# Altium project Relay.PrjPCB
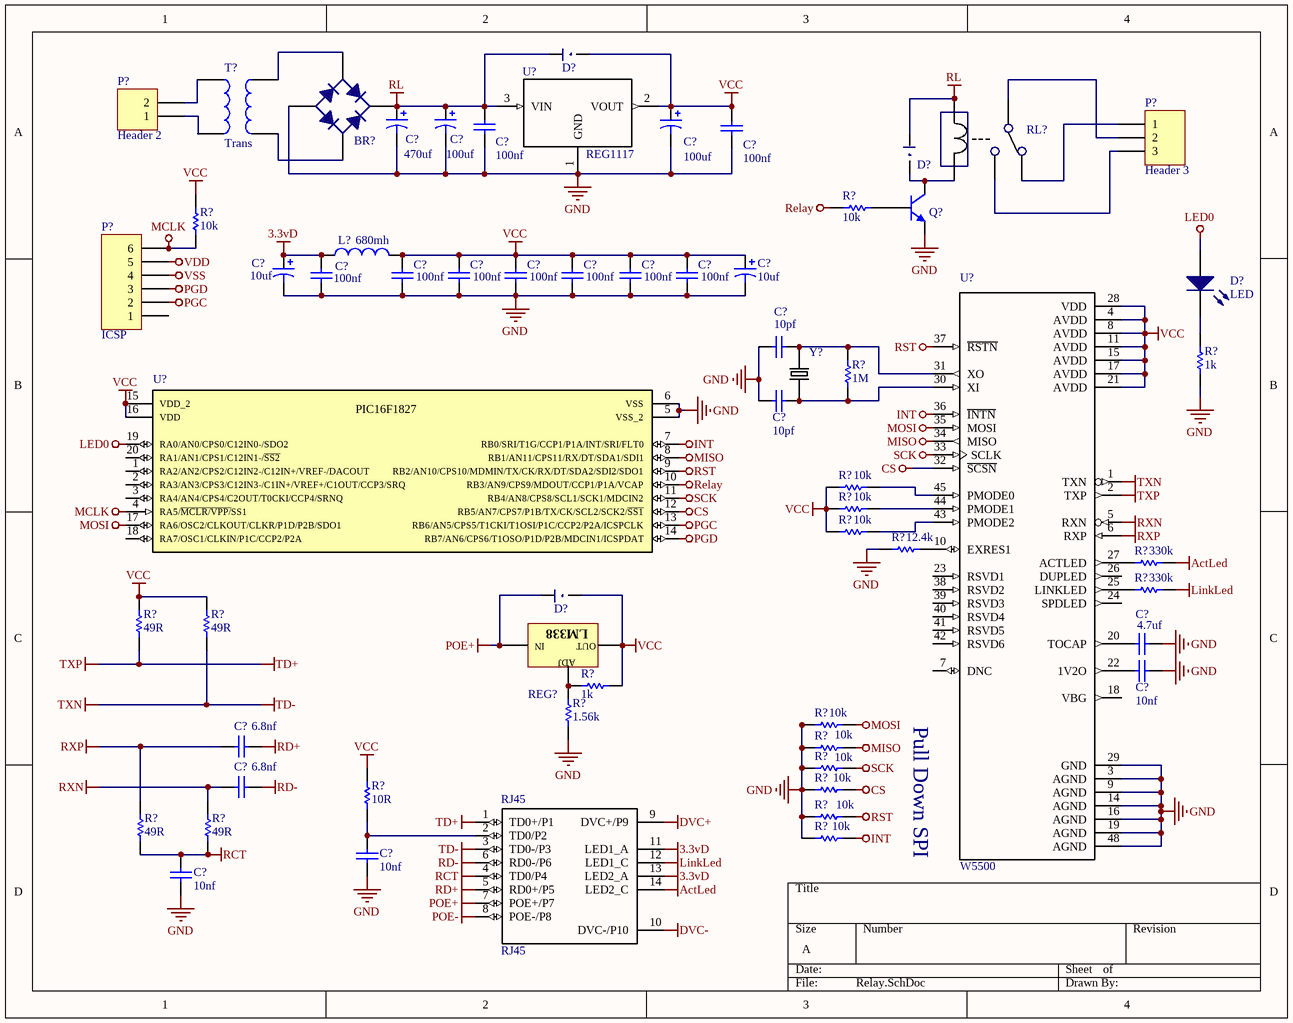
[diagram p0: Relay.SchDoc]
1 sheet, 63 parts. Net scope: global (net labels, ports and power ports of the same name join across sheets).
Board file: Relay_PCB.PcbDoc

## Sheet Relay.SchDoc
size A

### Parts
(Parts that share a designator on the sheet are numbered #1, #2 ... from top to bottom, then left to right.)
BR?  Puente Diodo Rectificador  [Bridge Rectifier 1]  (value not drawn)
C?#1  470uf  [Electrolytic Capacitor 1000uF 50V]
C?#2  100uf  [Electrolytic Capacitor 100uf-220uf 50V]
C?#3  100nf  [1206CAP]
C?#4  100uf  [Electrolytic Capacitor S]
C?#5  100nf  [1206CAP]
C?#6  10uf  [Electrolytic Capacitor S]
C?#7  100nf  [1206CAP]
C?#8  100nf  [1206CAP]
C?#9  100nf  [1206CAP]
C?#10  100nf  [1206CAP]
C?#11  100nf  [1206CAP]
C?#12  100nf  [1206CAP]
C?#13  100nf  [1206CAP]
C?#14  10uf  [Electrolytic Capacitor S]
C?#15  10pf  [1206CAP]
C?#16  10pf  [1206CAP]
C?#17  4.7uf  [1206CAP]
C?#18  10nf  [1206CAP]
C?#19  6.8nf  [1206CAP]
C?#20  6.8nf  [1206CAP]
C?#21  10nf  [1206CAP]
C?#22  10nf  [1206CAP]
D?#1  Diodo  [1206DIODE]  (value not drawn)
D?#2  Diodo  [1206DIODE]  (value not drawn)
D?#3  LED  [1206DIODE]
D?#4  Diodo  [1206DIODE]  (value not drawn)
L?  value 680mh  [Resistor 1/2 W]  (hidden comment: Inductor)
P?#1  Header 3  [HDR1X3]
P?#2  Header 2  [HDR1X2]
P?#3  ICSP  [HDR1X6]
Q?  Transistor NPN  [SOT-232N3904NPN]  (value not drawn)
R?#1  10k  [1206RES]
R?#2  10k  [1206RES]
R?#3  1k  [1206RES]
R?#4  1M  [1206RES]
R?#5  10k  [1206RES]
R?#6  10k  [1206RES]
R?#7  10k  [1206RES]
R?#8  12.4k  [1206RES]
R?#9  330k  [1206RES]
R?#10  330k  [1206RES]
R?#11  49R  [1206RES]
R?#12  49R  [1206RES]
R?#13  1k  [1206RES]
R?#14  1.56k  [1206RES]
R?#15  10k  [1206RES]
R?#16  10k  [1206RES]
R?#17  10k  [1206RES]
R?#18  10k  [1206RES]
R?#19  10R  [1206RES]
R?#20  10k  [1206RES]
R?#21  49R  [1206RES]
R?#22  49R  [1206RES]
R?#23  10k  [1206RES]
REG?  LM338  [TO-220]  (value not drawn)
RJ45  RJ45  [RJ45]
RL?  Relay SPDT  [SPDT Relay]  (value not drawn)
T?  Trans  [TRANS]
U?#1  REG1117  [SOT223]
U?#2  W5500  [QFP50P900X900X160-48N]
U?#3  PIC16F1827-I/SS  [SSOP-20]  (value not drawn)
Y?  E  [XTAL]  (value not drawn)

### Nets
3.3vD: C?#6.1 C?#7.2 L?.1 RJ45.11(LED1_A) RJ45.13(LED2_A)
ActLed: R?#9.2 RJ45.14(LED2_C)
CS: R?#18.2 U?#2.32(~{SCSN}) U?#3.12(RB5/AN7/CPS7/P1B/TX/CK/SCL2/SCK2/~{SS1})
DVC+: RJ45.9(DVC+/P9)
DVC-: RJ45.10(DVC-/P10)
GND: BR?.3(A) C?#1.2 C?#2.2 C?#3.1 C?#4.2 C?#5.1 C?#6.2 C?#7.1 C?#8.1 C?#9.1 C?#10.1 C?#11.1 C?#12.1 C?#13.1 C?#14.2 C?#15.1 C?#16.1 C?#17.2 C?#18.2 C?#21.2 C?#22.2 Q?.1(E) R?#3.2 R?#8.1 R?#14.1 R?#15.1 R?#16.1 R?#17.1 R?#18.1 R?#20.1 R?#23.1 U?#1.1(GND) U?#2.3(AGND) U?#2.9(AGND) U?#2.14(AGND) U?#2.16(AGND) U?#2.19(AGND) U?#2.29(GND) U?#2.48(AGND) U?#3.5(VSS_2) U?#3.6(VSS)
INT: R?#23.2 U?#2.36(~{INTN}) U?#3.7(RB0/SRI/T1G/CCP1/P1A/INT/SRI/FLT0)
LED0: D?#3.1(A) U?#3.19(RA0/AN0/CPS0/C12IN0-/SDO2)
LinkLed: R?#10.2 RJ45.12(LED1_C)
MCLK: P?#3.6 R?#2.1 U?#3.4(RA5/~{MCLR/VPP/}SS1)
MISO: R?#16.2 U?#2.34(MISO) U?#3.8(RB1/AN11/CPS11/RX/DT/SDA1/SDI1)
MOSI: R?#15.2 U?#2.35(MOSI) U?#3.17(RA6/OSC2/CLKOUT/CLKR/P1D/P2B/SDO1)
PGC: P?#3.2 U?#3.13(RB6/AN5/CPS5/T1CKI/T1OSI/P1C/CCP2/P2A/ICSPCLK)
PGD: P?#3.3 U?#3.14(RB7/AN6/CPS6/T1OSO/P1D/P2B/MDCIN1/ICSPDAT)
POE+: D?#4.2 REG?.3 RJ45.7(POE+/P7)
POE-: RJ45.8(POE-/P8)
RCT: C?#22.1 R?#21.2 R?#22.2 RJ45.4(TD0/P4)
RD+: C?#19.1 RJ45.5(RD0+/P5)
RD-: C?#20.1 RJ45.6(RD0-/P6)
Relay: R?#1.2 U?#3.10(RB3/AN9/CPS9/MDOUT/CCP1/P1A/VCAP)
RL: BR?.1(K) C?#1.1 C?#2.1 C?#3.2 D?#1.2 D?#2.2 RL?.1 U?#1.3(VIN)
RST: R?#20.2 U?#2.37(~{RSTN}) U?#3.9(RB2/AN10/CPS10/MDMIN/TX/CK/RX/DT/SDA2/SDI2/SDO1)
RXN: C?#20.2 R?#22.1 U?#2.5(RXN)
RXP: C?#19.2 R?#21.1 U?#2.6(RXP)
SCK: R?#17.2 U?#2.33(SCLK) U?#3.11(RB4/AN8/CPS8/SCL1/SCK1/MDCIN2)
TD+: R?#11.2 RJ45.1(TD0+/P1) U?#2.2(TXP)  [also labelled TXP]
TD-: R?#12.2 RJ45.3(TD0-/P3) U?#2.1(TXN)  [also labelled TXN]
VCC: C?#4.1 C?#5.2 C?#8.2 C?#9.2 C?#10.2 C?#11.2 C?#12.2 C?#13.2 C?#14.1 D?#1.1 D?#4.1 L?.2 R?#2.2 R?#5.1 R?#6.1 R?#7.1 R?#11.1 R?#12.1 R?#13.2 R?#19.1 REG?.2 U?#1.2(VOUT) U?#2.4(AVDD) U?#2.8(AVDD) U?#2.11(AVDD) U?#2.15(AVDD) U?#2.17(AVDD) U?#2.21(AVDD) U?#2.28(VDD) U?#3.15(VDD_2) U?#3.16(VDD)
VDD: P?#3.5
VSS: P?#3.4
NetBR?_2: BR?.2(C) T?.3
NetBR?_4: BR?.4(C) T?.4
NetC?#15_2: C?#15.2 R?#4.2 U?#2.31(XO) Y?.1
NetC?#16_2: C?#16.2 R?#4.1 U?#2.30(XI) Y?.2
NetC?#17_1: C?#17.1 U?#2.20(TOCAP)
NetC?#18_1: C?#18.1 U?#2.22(1V2O)
NetC?#21_1: C?#21.1 R?#19.2 RJ45.2(TD0/P2)
NetD?#2_1: D?#2.1 Q?.3(C) RL?.2
NetD?#3_2: D?#3.2(K) R?#3.1
NetP?#1_1: P?#1.1 RL?.5
NetP?#1_2: P?#1.2 RL?.3
NetP?#1_3: P?#1.3 RL?.4
NetP?#2_1: P?#2.1 T?.2
NetP?#2_2: P?#2.2 T?.1
NetQ?_2: Q?.2(B) R?#1.1
NetR?#5_2: R?#5.2 U?#2.45(PMODE0)
NetR?#6_2: R?#6.2 U?#2.44(PMODE1)
NetR?#7_2: R?#7.2 U?#2.43(PMODE2)
NetR?#8_2: R?#8.2 U?#2.10(EXRES1)
NetR?#9_1: R?#9.1 U?#2.27(ACTLED)
NetR?#10_1: R?#10.1 U?#2.25(LINKLED)
NetR?#13_1: R?#13.1 R?#14.2 REG?.1

Not connected (* = marked no-connect by the designer): P?#3 1; U?#2 7(DNC) 18(VBG) 23(RSVD1) 24(SPDLED) 26(DUPLED) 38(RSVD2) 39(RSVD3) 40(RSVD4) 41(RSVD5) 42(RSVD6); U?#3 1(RA2/AN2/CPS2/C12IN2-/C12IN+/VREF-/DACOUT) 2(RA3/AN3/CPS3/C12IN3-/C1IN+/VREF+/C1OUT/CCP3/SRQ) 3(RA4/AN4/CPS4/C2OUT/T0CKI/CCP4/SRNQ) 18(RA7/OSC1/CLKIN/P1C/CCP2/P2A) 20(RA1/AN1/CPS1/C12IN1-/~{SS2})

### Notes on the sheet
- (near U?#2) Pull Down SPI
- (in symbol LM338) IN; OUT; ADJ
- (in symbol PIC16F1827-I/SS) PIC16F1827

### Library data of the parts
C?#1 C?#2 C?#4 C?#6 C?#14 = Capacitor Electrolitico
C?#3 C?#5 C?#7-C?#13 C?#15-C?#22 = Capacitor de paso
D?#3 = LED: Typical LED; Published: 8-Jun-2000; LatestRevisionDate: 17-Jul-2002; LatestRevisionNote: Re-released for DXP Platform.; PackageVersion: Feb-2002; PackageReference: 3.2X1.6X1.1; Publisher: Altium Limited
L? = Inductor: Code_IEC: 1005; Published: 8-Jun-2000; LatestRevisionDate: 29-May-2009; LatestRevisionNote: IPC-7351 Footprint Added.; PackageReference: 0402-A; Publisher: Altium Limited; PackageDescription: Chip Inductor; Code_JEITA: 0402
P?#1 = Header 3: Header, 3-Pin; LatestRevisionDate: 17-Jul-2002; LatestRevisionNote: Re-released for DXP Platform.; Publisher: Altium Limited
P?#2 = Header 2: Header, 2-Pin; LatestRevisionDate: 17-Jul-2002; LatestRevisionNote: Re-released for DXP Platform.; Publisher: Altium Limited
P?#3 = Header 6: Header, 6-Pin; LatestRevisionDate: 17-Jul-2002; LatestRevisionNote: Re-released for DXP Platform.; Publisher: Altium Limited
R?#1-R?#23 = Resistor
REG? = LM338: Variable Voltage Regulator
RJ45 = RJ45Poe
T? = Trans: Transformer; Published: 24-Mar-1999; LatestRevisionDate: 08-Jul-2005; LatestRevisionNote: Mech Layer 1 removed.; PackageReference: TRANS; Publisher: Altium Limited; PackageDescription: Transformer; 4 Leads
U?#1 = REG1117: LDO Regulator Pos 1.25V to 13.5V 0.8A 4-Pin_3+Tab_ SOT-223 Tube; MF: Texas Instruments; Digi-Key_Purchase_URL: https://www.digikey.com/product-detail/en/texas-instruments/REG1117/REG1117-ND/251211?utm_source=snapeda&utm_medium=aggregator&utm_campaign=symbol; MP: REG1117; Package: SOT-223-4 Texas Instruments; Digi-Key_Part_Number: REG1117-ND; SnapEDA_Link: https://www.snapeda.com/parts/REG1117/Texas%20Instruments/view-part/?ref=snap; Value: *
U?#2 = W5500: Victor Pure White Collection Wood Tidy Tower Organizer; MF: WIZnet; Package: LQFP-48 Victor Technologies; Price: None; Availability: Unavailable; MP: W5500; SnapEDA_Link: https://www.snapeda.com/parts/W5500/WIZnet/view-part/?ref=snap; Value: *
U?#3 = PIC16F1827-I/SS: PIC12 Series 384 B RAM 7 kB Flash 80 MHz 8-Bit Microcontroller SMT - SSOP-20; MF: Microchip; MP: PIC16F1827-I/SS; Digi-Key_Purchase_URL: https://www.digikey.do/product-detail/en/microchip-technology/PIC16F1827-I-SS/PIC16F1827-I-SS-ND/2201967?utm_source=snapeda&utm_medium=aggregator&utm_campaign=symbol; Package: SSOP-20 Microchip; SnapEDA_Link: https://www.snapeda.com/parts/PIC16F1827-I/SS/Microchip/view-part/?ref=snap; Digi-Key_Part_Number: PIC16F1827-I/SS-ND; Value: *
Y? = ECS-160-20-20A-TR: Semi-Frequency Controls-Surface Mount Crystals; MF: ECS Inc.; MP: ECS-160-20-20A-TR; Package: SMD-2 ECS International; Availability: Unavailable; Price: None; SnapEDA_Link: https://www.snapeda.com/parts/ECS-160-20-20A-TR/ECS%20Inc./view-part/?ref=snap; Value: *